# Altium schematic sheet SMS.SchDoc
size A3; SheetNumber: 1; SheetTotal: 1
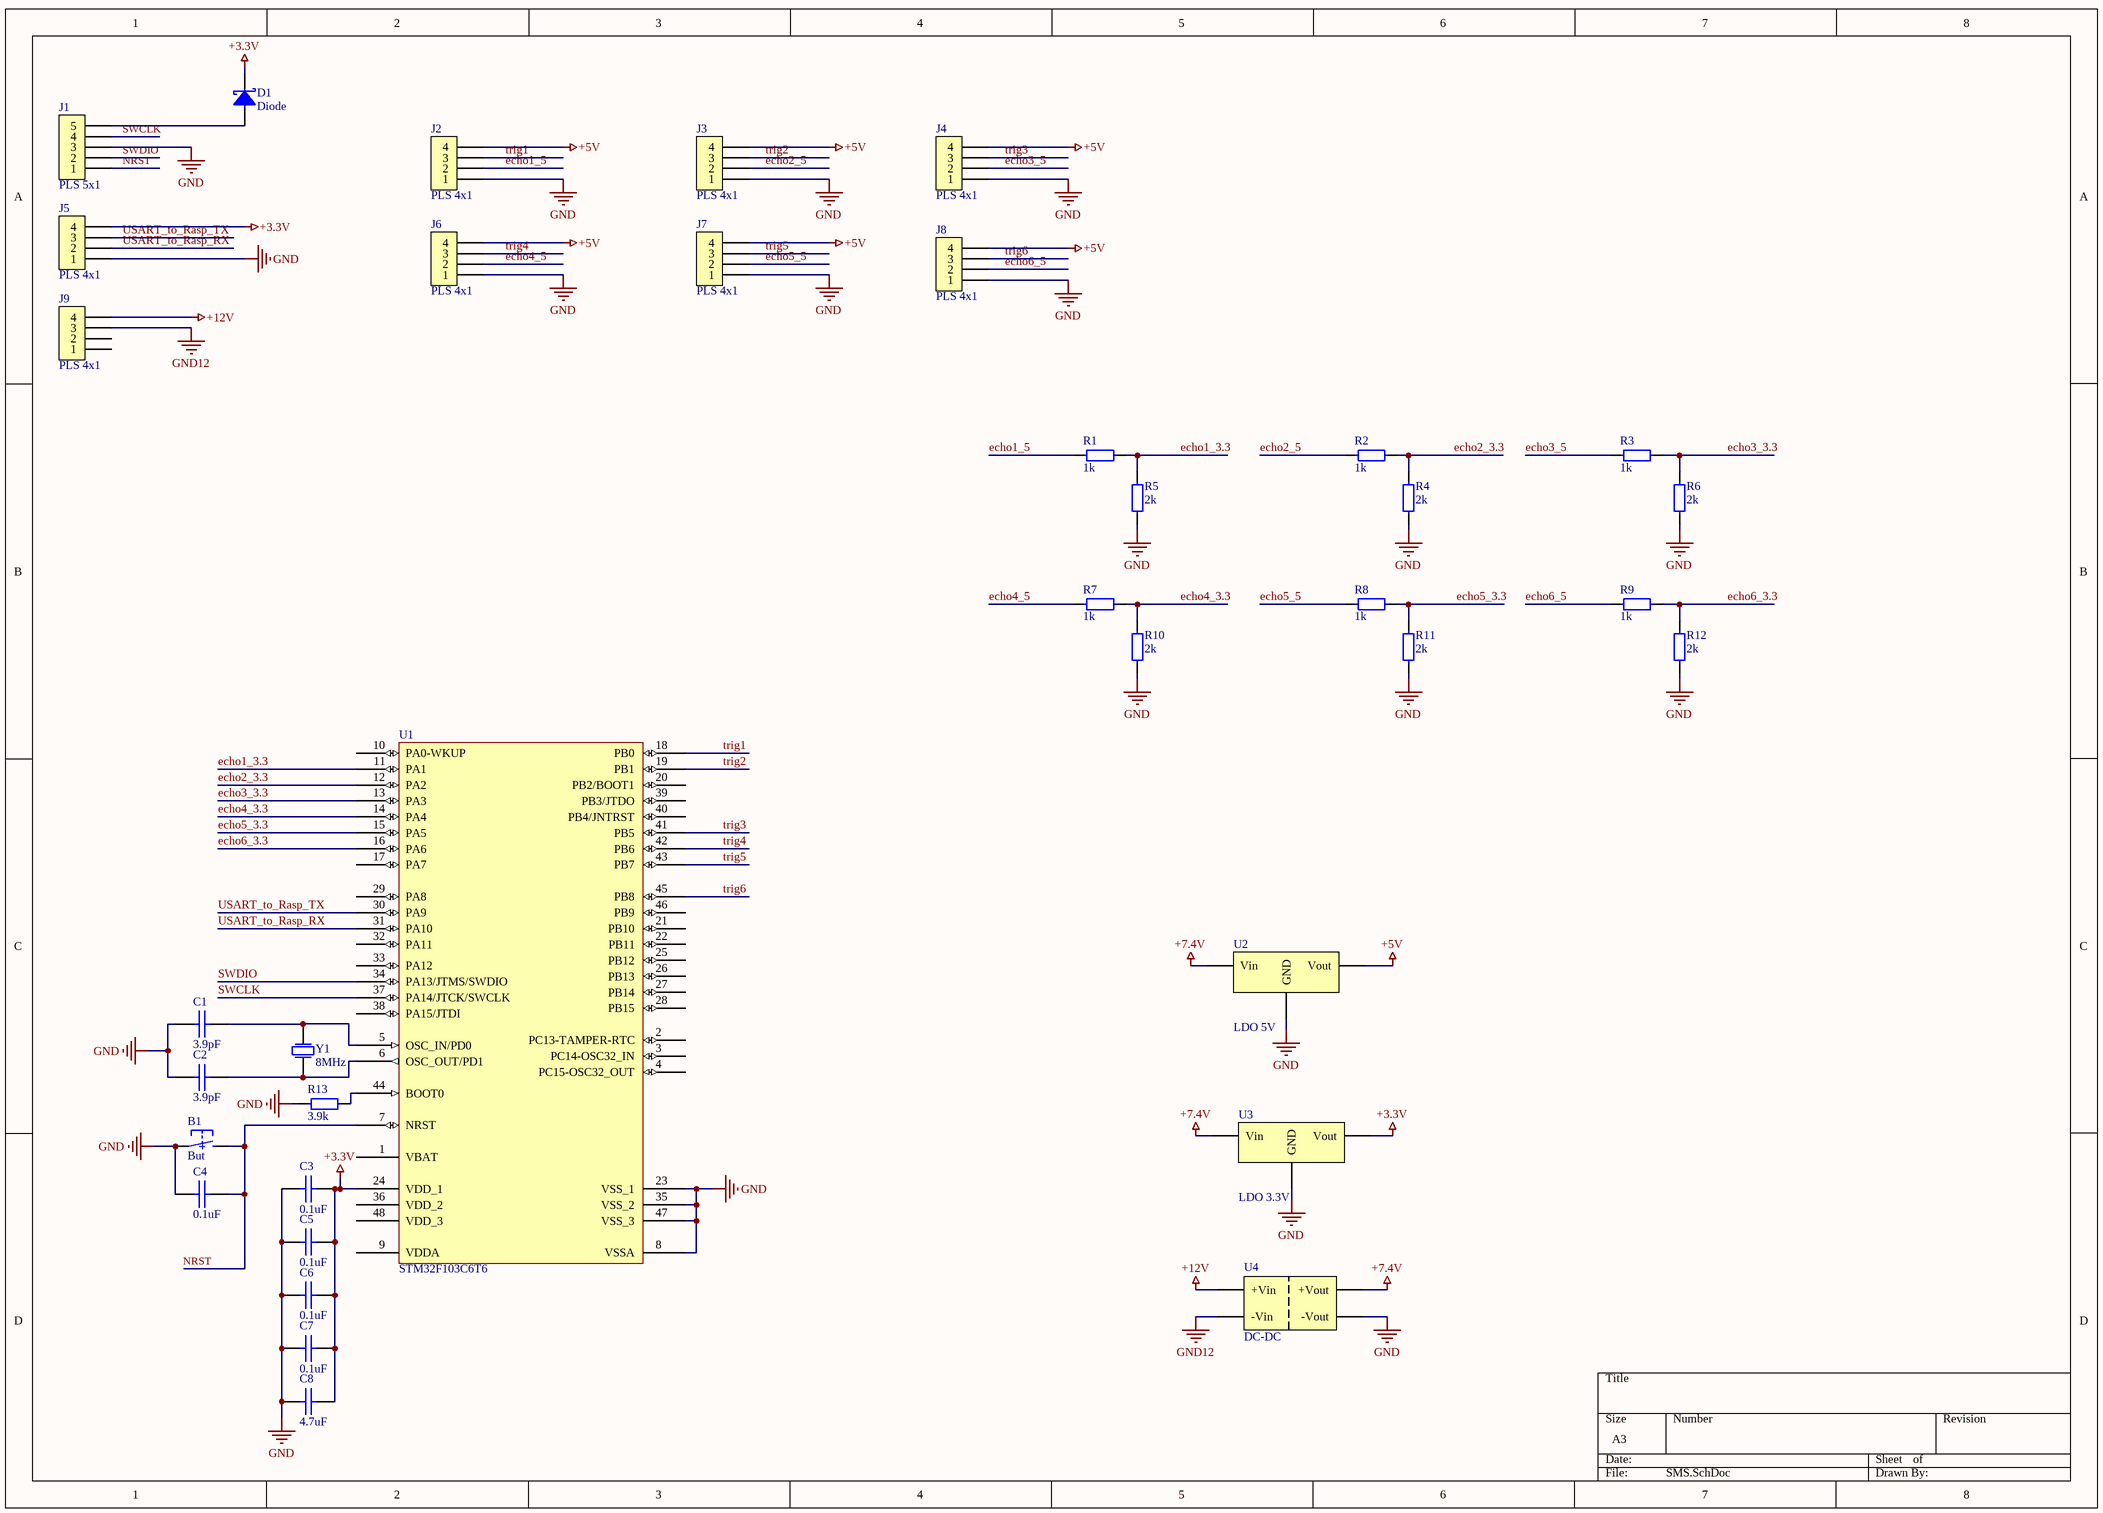
[diagram p0: SMS.SchDoc]

## Parts
B1  But  [BUTTON 6x3.5]
C1  3.9pF  [0805 Capicator]
C2  3.9pF  [0805 Capicator]
C3  0.1uF  [0805 Capicator]
C4  0.1uF  [0805 Capicator]
C5  0.1uF  [0805 Capicator]
C6  0.1uF  [0805 Capicator]
C7  0.1uF  [0805 Capicator]
C8  4.7uF  [0805 Capicator]
D1  Diode  [sod-123]
J1  PLS 5x1  [PLS 5x1]
J2  PLS 4x1  [PLS 4x1]
J3  PLS 4x1  [PLS 4x1]
J4  PLS 4x1  [PLS 4x1]
J5  PLS 4x1  [PLS 4x1]
J6  PLS 4x1  [PLS 4x1]
J7  PLS 4x1  [PLS 4x1]
J8  PLS 4x1  [PLS 4x1]
J9  PLS 4x1  [PLS 4x1]
R1  1k  [0805 Resistor]
R2  1k  [0805 Resistor]
R3  1k  [0805 Resistor]
R4  2k  [0805 Resistor]
R5  2k  [0805 Resistor]
R6  2k  [0805 Resistor]
R7  1k  [0805 Resistor]
R8  1k  [0805 Resistor]
R9  1k  [0805 Resistor]
R10  2k  [0805 Resistor]
R11  2k  [0805 Resistor]
R12  2k  [0805 Resistor]
R13  3.9k  [0805 Resistor]
U1  STM32F103C6T6  [STM32F103C6T6]
U2  LDO 5V  [TO-252]
U3  LDO 3.3V  [SOT-223]
U4  DC-DC  [DC-DC]
Y1  8MHz  [hc-49sm]

## Nets
+3.3V: C3.2 C5.2 C6.2 C7.2 C8.2 D1.2 J5.4 U1.24(VDD_1) U3.2(Vout)
+5V: J2.4 J3.4 J4.4 J6.4 J7.4 J8.4 U2.2(Vout)
+7.4V: U2.3(Vin) U3.3(Vin) U4.3(+Vout)
+12V: J9.4 U4.1(+Vin)
GND: B1.1 C1.1 C2.1 C3.1 C4.1 C5.1 C6.1 C7.1 C8.1 J1.3 J2.1 J3.1 J4.1 J5.1 J6.1 J7.1 J8.1 R4.1 R5.1 R6.1 R10.1 R11.1 R12.1 R13.1 U1.8(VSSA) U1.23(VSS_1) U1.35(VSS_2) U1.47(VSS_3) U2.1(GND) U3.1(GND) U4.4(-Vout)
GND12: J9.3 U4.2(-Vin)
echo1_3.3: R1.2 R5.2 U1.11(PA1)
echo1_5: J2.2 R1.1
echo2_3.3: R2.2 R4.2 U1.12(PA2)
echo2_5: J3.2 R2.1
echo3_3.3: R3.2 R6.2 U1.13(PA3)
echo3_5: J4.2 R3.1
echo4_3.3: R7.2 R10.2 U1.14(PA4)
echo4_5: J6.2 R7.1
echo5_3.3: R8.2 R11.2 U1.15(PA5)
echo5_5: J7.2 R8.1
echo6_3.3: R9.2 R12.2 U1.16(PA6)
echo6_5: J8.2 R9.1
NRST: B1.2 C4.2 J1.1 U1.7(NRST)
SWCLK: J1.4 U1.37(PA14/JTCK/SWCLK)
SWDIO: J1.2 U1.34(PA13/JTMS/SWDIO)
trig1: J2.3 U1.18(PB0)
trig2: J3.3 U1.19(PB1)
trig3: J4.3 U1.41(PB5)
trig4: J6.3 U1.42(PB6)
trig5: J7.3 U1.43(PB7)
trig6: J8.3 U1.45(PB8)
USART_to_Rasp_RX: J5.2 U1.31(PA10)
USART_to_Rasp_TX: J5.3 U1.30(PA9)
NetC1_2: C1.2 U1.5(OSC_IN/PD0) Y1.2
NetC2_2: C2.2 U1.6(OSC_OUT/PD1) Y1.1
NetD1_1: D1.1 J1.5
NetR13_2: R13.2 U1.44(BOOT0)

Not connected (* = marked no-connect by the designer): J9 1 2; U1 1(VBAT) 2(PC13-TAMPER-RTC) 3(PC14-OSC32_IN) 4(PC15-OSC32_OUT) 9(VDDA) 10(PA0-WKUP) 17(PA7) 20(PB2/BOOT1) 21(PB10) 22(PB11) 25(PB12) 26(PB13) 27(PB14) 28(PB15) 29(PA8) 32(PA11) 33(PA12) 36(VDD_2) 38(PA15/JTDI) 39(PB3/JTDO) 40(PB4/JNTRST) 46(PB9) 48(VDD_3)

## Library data of the parts
B1 = Button: Button 2 Conn SMD
C1 C2 = Cap 39pF
C3-C7 = Cap 0.1uF
C8 = Cap 4.7uF
D1 = Diode Schottky: 0.5 A, Low Forward Voltage less than 385 mV, 400 mW Power Dissipation Package
J1 = Conn 5: Header, 5-Pin
J2-J9 = Conn 4: Header, 4-Pin
R1-R3 R7-R9 = Res 1k
R4-R6 R10-R12 = Res 2k
R13 = Res 3.9k
U2 = LDO 5V: LDO Regulator Pos 5V 1A
U3 = LDO 3.3V: LDO Regulator Pos 3.3V 1.3A 4-Pin(3+Tab) SOT-223 T/R
Y1 = Crystal 8MHz: Crystal. HC-49SM (US)